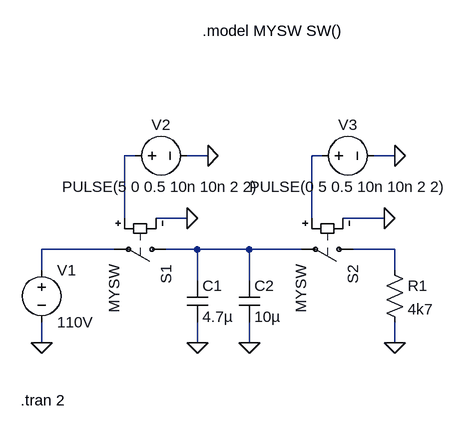
[diagram p0: schematic Discharge.asc]
Discharge.asc, the LTspice schematic file:
Version 4.1
SHEET 1 880 680
WIRE -80 -96 -96 -96
WIRE 32 -96 0 -96
WIRE 208 -96 192 -96
WIRE 320 -96 288 -96
WIRE -96 0 -96 -96
WIRE 0 0 -48 0
WIRE 192 0 192 -96
WIRE 304 0 240 0
WIRE -112 48 -224 48
WIRE 16 48 -32 48
WIRE 96 48 16 48
WIRE 176 48 96 48
WIRE 320 48 256 48
WIRE -224 80 -224 48
WIRE 320 80 320 48
WIRE 16 96 16 48
WIRE 96 96 96 48
WIRE -224 192 -224 160
WIRE 16 192 16 160
WIRE 96 192 96 160
WIRE 320 192 320 160
FLAG 16 192 0
FLAG 96 192 0
FLAG -224 192 0
FLAG 320 192 0
FLAG 0 0 0
FLAG 304 0 0
FLAG 32 -96 0
FLAG 320 -96 0
SYMBOL cap 0 96 R0
SYMATTR InstName C1
SYMATTR Value 4.7µ
SYMBOL cap 80 96 R0
SYMATTR InstName C2
SYMATTR Value 10µ
SYMBOL voltage -224 64 R0
WINDOW 123 0 0 Left 0
WINDOW 39 0 0 Left 0
SYMATTR InstName V1
SYMATTR Value 110V
SYMBOL sw -16 48 R90
SYMATTR InstName S1
SYMATTR Value MYSW
SYMBOL sw 272 48 R90
SYMATTR InstName S2
SYMATTR Value MYSW
SYMBOL res 304 64 R0
SYMATTR InstName R1
SYMATTR Value 4k7
SYMBOL voltage -96 -96 R270
WINDOW 0 32 56 VTop 2
WINDOW 3 -32 56 VBottom 2
WINDOW 123 0 0 Left 0
WINDOW 39 0 0 Left 0
SYMATTR InstName V2
SYMATTR Value PULSE(5 0 0.5 10n 10n 2 2)
SYMBOL voltage 192 -96 R270
WINDOW 0 32 56 VTop 2
WINDOW 3 -32 56 VBottom 2
WINDOW 123 0 0 Left 0
WINDOW 39 0 0 Left 0
SYMATTR InstName V3
SYMATTR Value PULSE(0 5 0.5 10n 10n 2 2)
TEXT 24 -288 Left 2 !.model MYSW SW()
TEXT -256 280 Left 2 !.tran 2

The netlist it stands for:
* Discharge.asc
C1 N004 0 4.7µ
C2 N004 0 10µ
V1 N003 0 110V
S1 N004 N003 N001 0 MYSW
S2 N005 N004 N002 0 MYSW
R1 N005 0 4k7
V2 N001 0 PULSE(5 0 0.5 10n 10n 2 2)
V3 N002 0 PULSE(0 5 0.5 10n 10n 2 2)
.model MYSW SW()
.tran 2
.backanno
.end